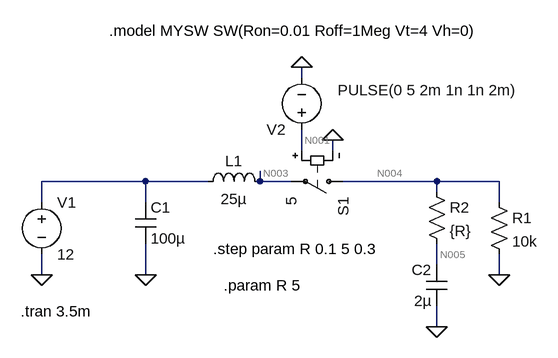
[diagram p0: schematic AC-adapter-transient-analysis.asc]
AC-adapter-transient-analysis.asc, the LTspice schematic file:
Version 4
SHEET 1 880 680
WIRE 480 -64 480 -80
WIRE 480 48 480 16
WIRE 528 48 528 32
WIRE 240 96 80 96
WIRE 336 96 240 96
WIRE 416 96 416 80
WIRE 464 96 416 96
WIRE 688 96 544 96
WIRE 784 96 688 96
WIRE 688 112 688 96
WIRE 80 128 80 96
WIRE 240 128 240 96
WIRE 784 128 784 96
WIRE 688 224 688 192
WIRE 80 240 80 208
WIRE 240 240 240 192
WIRE 784 240 784 208
WIRE 688 320 688 288
FLAG 528 32 0
FLAG 480 -80 0
FLAG 80 240 0
FLAG 240 240 0
FLAG 688 320 0
FLAG 784 240 0
SYMBOL voltage 80 112 R0
WINDOW 123 0 0 Left 0
WINDOW 39 0 0 Left 0
SYMATTR InstName V1
SYMATTR Value 12
SYMBOL cap 224 128 R0
SYMATTR InstName C1
SYMATTR Value 100µ
SYMBOL ind 320 112 R270
WINDOW 0 32 56 VTop 2
WINDOW 3 5 56 VBottom 2
SYMATTR InstName L1
SYMATTR Value 25µ
SYMATTR SpiceLine Rser=1
SYMBOL cap 704 288 R180
WINDOW 0 24 56 Left 2
WINDOW 3 24 8 Left 2
SYMATTR InstName C2
SYMATTR Value 2µ
SYMBOL sw 560 96 R90
SYMATTR InstName S1
SYMATTR Value 5
SYMATTR SpiceModel MYSW
SYMBOL voltage 480 32 R180
WINDOW 123 0 0 Left 0
WINDOW 39 0 0 Left 0
WINDOW 3 -332 77 Left 2
SYMATTR InstName V2
SYMATTR Value PULSE(0 5 2m 1n 1n 2m)
SYMBOL res 768 112 R0
SYMATTR InstName R1
SYMATTR Value 10k
SYMBOL res 672 96 R0
SYMATTR InstName R2
SYMATTR Value {R}
TEXT 48 296 Left 2 !.tran 3.5m
TEXT 184 -136 Left 2 !.model MYSW SW(Ron=0.01 Roff=1Meg Vt=4 Vh=0)
TEXT 360 256 Left 2 !.param R 5
TEXT 344 200 Left 2 !.step param R 0.1 5 0.3

The netlist it stands for:
* AC-adapter-transient-analysis.asc
V1 N002 0 12
C1 N002 0 100µ
L1 N002 N003 25µ Rser=1
C2 0 N005 2µ
S1 N004 N003 N001 0 MYSW 5
V2 N001 0 PULSE(0 5 2m 1n 1n 2m)
R1 N004 0 10k
R2 N004 N005 {R}
.tran 3.5m
.model MYSW SW(Ron=0.01 Roff=1Meg Vt=4 Vh=0)
.param R 5
.step param R 0.1 5 0.3
.backanno
.end

* Results of the author's LTspice run, read from the files saved beside the schematic
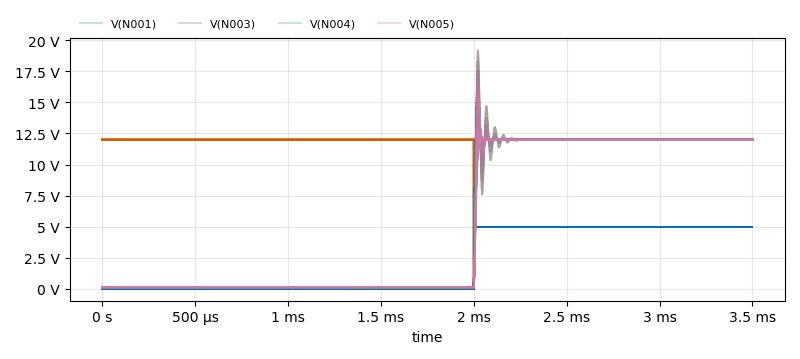
[diagram p1: Transient Analysis of AC-adapter-transient-analysis.asc, plotted from the saved traces]
* Transient Analysis, 18 runs:
*   V(N001) [run 1]: min 0 V, max 5 V, average 2.143 V, rms 3.273 V, last 5 V
*   V(N001) [run 2]: min 0 V, max 5 V, average 2.143 V, rms 3.273 V, last 5 V
*   V(N001) [run 3]: min 0 V, max 5 V, average 2.143 V, rms 3.273 V, last 5 V
*   V(N001) [run 4]: min 0 V, max 5 V, average 2.143 V, rms 3.273 V, last 5 V
*   V(N001) [run 5]: min 0 V, max 5 V, average 2.143 V, rms 3.273 V, last 5 V
*   V(N001) [run 6]: min 0 V, max 5 V, average 2.143 V, rms 3.273 V, last 5 V
*   V(N001) [run 7]: min 0 V, max 5 V, average 2.143 V, rms 3.273 V, last 5 V
*   V(N001) [run 8]: min 0 V, max 5 V, average 2.143 V, rms 3.273 V, last 5 V
*   V(N003) [run 1]: min 118.8 mV, max 19.19 V, average 11.99 V, rms 12.01 V, last 12 V
*   V(N003) [run 2]: min 118.8 mV, max 18.29 V, average 11.99 V, rms 12.01 V, last 12 V
*   V(N003) [run 3]: min 118.8 mV, max 17.51 V, average 11.99 V, rms 12.01 V, last 12 V
*   V(N003) [run 4]: min 118.8 mV, max 16.84 V, average 11.99 V, rms 12 V, last 12 V
*   V(N003) [run 5]: min 118.8 mV, max 16.28 V, average 11.99 V, rms 12 V, last 12 V
*   V(N003) [run 6]: min 118.8 mV, max 15.81 V, average 11.99 V, rms 12 V, last 12 V
*   V(N003) [run 7]: min 118.8 mV, max 15.39 V, average 11.99 V, rms 12 V, last 12 V
*   V(N003) [run 8]: min 118.8 mV, max 15.01 V, average 11.99 V, rms 12 V, last 12 V
*   V(N004) [run 1]: min 118.8 mV, max 19.19 V, average 5.203 V, rms 7.876 V, last 12 V
*   V(N004) [run 2]: min 118.8 mV, max 18.29 V, average 5.203 V, rms 7.869 V, last 12 V
*   V(N004) [run 3]: min 118.8 mV, max 17.51 V, average 5.203 V, rms 7.865 V, last 12 V
*   V(N004) [run 4]: min 118.8 mV, max 16.84 V, average 5.203 V, rms 7.862 V, last 12 V
*   V(N004) [run 5]: min 118.8 mV, max 16.27 V, average 5.203 V, rms 7.86 V, last 12 V
*   V(N004) [run 6]: min 118.8 mV, max 15.81 V, average 5.203 V, rms 7.858 V, last 12 V
*   V(N004) [run 7]: min 118.8 mV, max 15.38 V, average 5.203 V, rms 7.856 V, last 12 V
*   V(N004) [run 8]: min 118.8 mV, max 15 V, average 5.203 V, rms 7.855 V, last 12 V
*   V(N005) [run 1]: min 118.8 mV, max 19.19 V, average 5.202 V, rms 7.875 V, last 12 V
*   V(N005) [run 2]: min 118.8 mV, max 18.25 V, average 5.2 V, rms 7.867 V, last 12 V
*   V(N005) [run 3]: min 118.8 mV, max 17.41 V, average 5.198 V, rms 7.861 V, last 12 V
*   V(N005) [run 4]: min 118.8 mV, max 16.7 V, average 5.196 V, rms 7.855 V, last 12 V
*   V(N005) [run 5]: min 118.8 mV, max 16.03 V, average 5.194 V, rms 7.851 V, last 12 V
*   V(N005) [run 6]: min 118.8 mV, max 15.43 V, average 5.192 V, rms 7.847 V, last 12 V
*   V(N005) [run 7]: min 118.8 mV, max 14.89 V, average 5.19 V, rms 7.843 V, last 12 V
*   V(N005) [run 8]: min 118.8 mV, max 14.39 V, average 5.188 V, rms 7.84 V, last 12 V